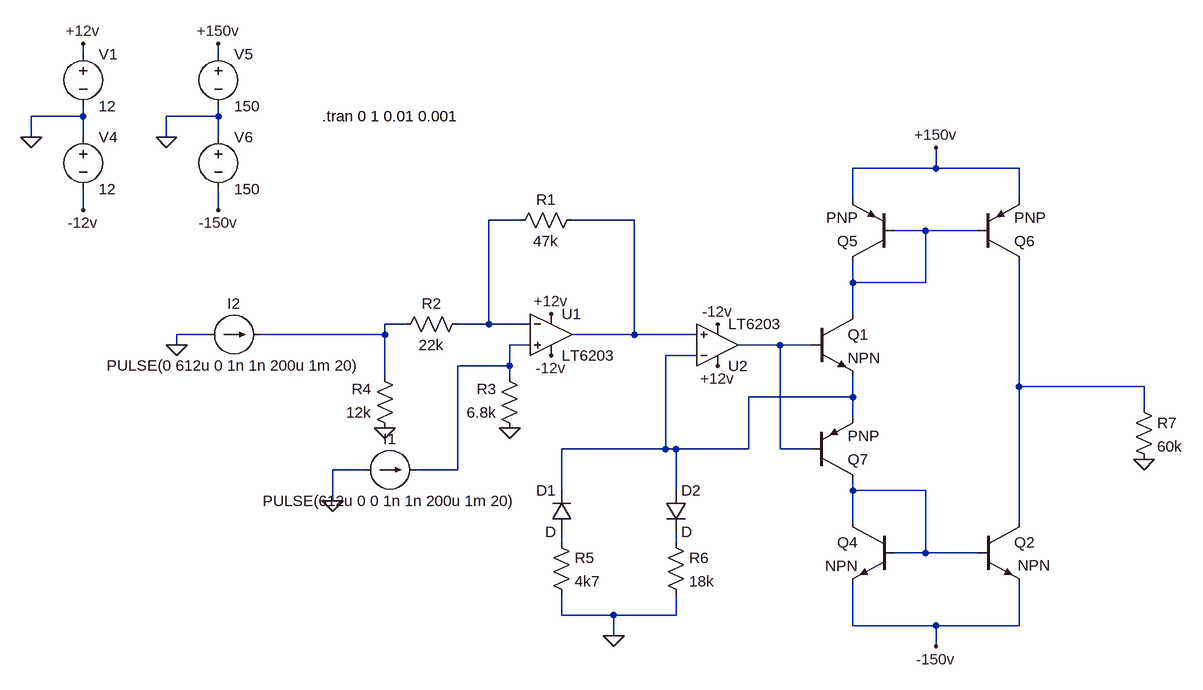
[diagram p0: schematic Fuente de Corrientes Tesis.asc]
Fuente de Corrientes Tesis.asc, the LTspice schematic file:
Version 4
SHEET 1 880 836
WIRE -864 -208 -864 -224
WIRE -656 -208 -656 -224
WIRE -864 -112 -864 -128
WIRE -864 -112 -944 -112
WIRE -656 -112 -656 -128
WIRE -656 -112 -736 -112
WIRE -944 -80 -944 -112
WIRE -864 -80 -864 -112
WIRE -736 -80 -736 -112
WIRE -656 -80 -656 -112
WIRE 448 -32 448 -64
WIRE 448 -32 320 -32
WIRE 576 -32 448 -32
WIRE 320 16 320 -32
WIRE 576 16 576 -32
WIRE -864 32 -864 0
WIRE -656 32 -656 0
WIRE -192 48 -240 48
WIRE -16 48 -112 48
WIRE 432 64 384 64
WIRE 512 64 432 64
WIRE 320 144 320 112
WIRE 432 144 432 64
WIRE 432 144 320 144
WIRE 320 192 320 144
WIRE -368 208 -400 208
WIRE -240 208 -240 48
WIRE -240 208 -288 208
WIRE -176 208 -240 208
WIRE -672 224 -720 224
WIRE -400 224 -400 208
WIRE -400 224 -592 224
WIRE -16 224 -16 48
WIRE -16 224 -112 224
WIRE 80 224 -16 224
WIRE -720 240 -720 224
WIRE -176 240 -208 240
WIRE 208 240 144 240
WIRE 256 240 208 240
WIRE 80 256 32 256
WIRE -208 272 -208 240
WIRE -208 272 -288 272
WIRE -400 288 -400 224
WIRE -208 288 -208 272
WIRE 576 304 576 112
WIRE 768 304 576 304
WIRE 320 320 320 288
WIRE 320 320 160 320
WIRE 768 336 768 304
WIRE 320 352 320 320
WIRE 32 400 32 256
WIRE 32 400 -128 400
WIRE 48 400 32 400
WIRE 160 400 160 320
WIRE 160 400 48 400
WIRE 208 400 208 240
WIRE 256 400 208 400
WIRE -432 432 -480 432
WIRE -288 432 -288 272
WIRE -288 432 -352 432
WIRE -128 464 -128 400
WIRE 48 464 48 400
WIRE 320 464 320 448
WIRE 432 464 320 464
WIRE -480 480 -480 432
WIRE 320 512 320 464
WIRE 576 512 576 304
WIRE -128 544 -128 528
WIRE 48 544 48 528
WIRE 432 560 432 464
WIRE 432 560 384 560
WIRE 512 560 432 560
WIRE -128 656 -128 624
WIRE -48 656 -128 656
WIRE 48 656 48 624
WIRE 48 656 -48 656
WIRE 320 672 320 608
WIRE 448 672 320 672
WIRE 576 672 576 608
WIRE 576 672 448 672
WIRE -48 688 -48 656
WIRE 448 704 448 672
FLAG -48 688 0
FLAG -208 368 0
FLAG -400 368 0
FLAG -944 -80 0
FLAG -864 -224 +12v
FLAG -864 32 -12v
FLAG -480 480 0
FLAG -736 -80 0
FLAG -656 -224 +150v
FLAG -656 32 -150v
FLAG -144 192 +12v
FLAG 112 272 +12v
FLAG 112 208 -12v
FLAG -144 256 -12v
FLAG 448 -64 +150v
FLAG 448 704 -150v
FLAG 768 416 0
FLAG -720 240 0
SYMBOL OpAmps\\LT6203 -144 224 R0
SYMATTR InstName U1
SYMBOL OpAmps\\LT6203 112 240 M180
SYMATTR InstName U2
SYMBOL res -96 32 R90
WINDOW 0 0 56 VBottom 2
WINDOW 3 32 56 VTop 2
SYMATTR InstName R1
SYMATTR Value 47k
SYMBOL res -272 192 R90
WINDOW 0 0 56 VBottom 2
WINDOW 3 32 56 VTop 2
SYMATTR InstName R2
SYMATTR Value 22k
SYMBOL res -192 384 R180
WINDOW 0 36 76 Left 2
WINDOW 3 36 40 Left 2
SYMATTR InstName R3
SYMATTR Value 6.8k
SYMBOL res -384 384 R180
WINDOW 0 36 76 Left 2
WINDOW 3 36 40 Left 2
SYMATTR InstName R4
SYMATTR Value 12k
SYMBOL res -144 528 R0
SYMATTR InstName R5
SYMATTR Value 4k7
SYMBOL res 32 528 R0
SYMATTR InstName R6
SYMATTR Value 18k
SYMBOL diode -112 528 R180
WINDOW 0 24 64 Left 2
WINDOW 3 24 0 Left 2
SYMATTR InstName D1
SYMBOL diode 32 464 R0
SYMATTR InstName D2
SYMBOL npn 256 192 R0
SYMATTR InstName Q1
SYMBOL npn 512 512 R0
WINDOW 3 62 67 Left 2
SYMATTR InstName Q2
SYMBOL npn 384 512 M0
SYMATTR InstName Q4
SYMBOL pnp 384 112 R180
SYMATTR InstName Q5
SYMBOL pnp 512 112 M180
SYMATTR InstName Q6
SYMBOL pnp 256 448 M180
SYMATTR InstName Q7
SYMBOL current -432 432 R270
WINDOW 0 32 40 VTop 2
WINDOW 3 -32 40 VBottom 2
WINDOW 123 0 0 Left 0
WINDOW 39 0 0 Left 0
SYMATTR InstName I1
SYMATTR Value PULSE(612u 0 0 1n 1n 200u 1m 20)
SYMBOL voltage -864 -224 R0
WINDOW 123 0 0 Left 0
WINDOW 39 0 0 Left 0
SYMATTR InstName V1
SYMATTR Value 12
SYMBOL voltage -864 -96 R0
WINDOW 123 0 0 Left 0
WINDOW 39 0 0 Left 0
SYMATTR InstName V4
SYMATTR Value 12
SYMBOL voltage -656 -224 R0
WINDOW 123 0 0 Left 0
WINDOW 39 0 0 Left 0
SYMATTR InstName V5
SYMATTR Value 150
SYMBOL voltage -656 -96 R0
WINDOW 123 0 0 Left 0
WINDOW 39 0 0 Left 0
SYMATTR InstName V6
SYMATTR Value 150
SYMBOL res 752 320 R0
SYMATTR InstName R7
SYMATTR Value 60k
SYMBOL current -672 224 R270
WINDOW 0 32 40 VTop 2
WINDOW 3 -32 40 VBottom 2
WINDOW 123 0 0 Left 0
WINDOW 39 0 0 Left 0
SYMATTR InstName I2
SYMATTR Value PULSE(0 612u 0 1n 1n 200u 1m 20)
TEXT -496 -112 Left 2 !.tran 0 1 0.01 0.001

The netlist it stands for:
* Fuente de Corrientes Tesis.asc
* U1: LT6203 (symbol OpAmps\LT6203 not available, pins judged from their places): In+=N005 In-=N001 V+=+12v V-=-12v OUT=N002
* U2: LT6203 (symbol OpAmps\LT6203 not available, pins judged from their places): In+=N002 In-=N007 V+=+12v V-=-12v OUT=N006
R1 N002 N001 47k
R2 N001 N004 22k
R3 0 N005 6.8k
R4 0 N004 12k
R5 N010 0 4k7
R6 N011 0 18k
D1 N010 N007 D
D2 N007 N011 D
Q1 N003 N006 N007 0 NPN
Q2 N008 N009 -150v 0 NPN
Q4 N009 N009 -150v 0 NPN
Q5 N003 N003 +150v 0 PNP
Q6 N008 N003 +150v 0 PNP
Q7 N009 N006 N007 0 PNP
I1 0 N005 PULSE(612u 0 0 1n 1n 200u 1m 20)
V1 +12v 0 12
V4 0 -12v 12
V5 +150v 0 150
V6 0 -150v 150
R7 N008 0 60k
I2 0 N004 PULSE(0 612u 0 1n 1n 200u 1m 20)
.model D D
.lib standard.dio
.model NPN NPN
.model PNP PNP
.lib standard.bjt
.tran 0 1 0.01 0.001
.backanno
.end